# Altium schematic sheet DSO_IO.SchDoc: Schematic_Name
size A4; CompanyName: University of Melbourne; Engineer: Your Name Here; DocumentNumber: 1; Revision: 0.1; SheetNumber: 1; SheetTotal: 1; Title_Project: Project_Title; StudentNo: Student No.
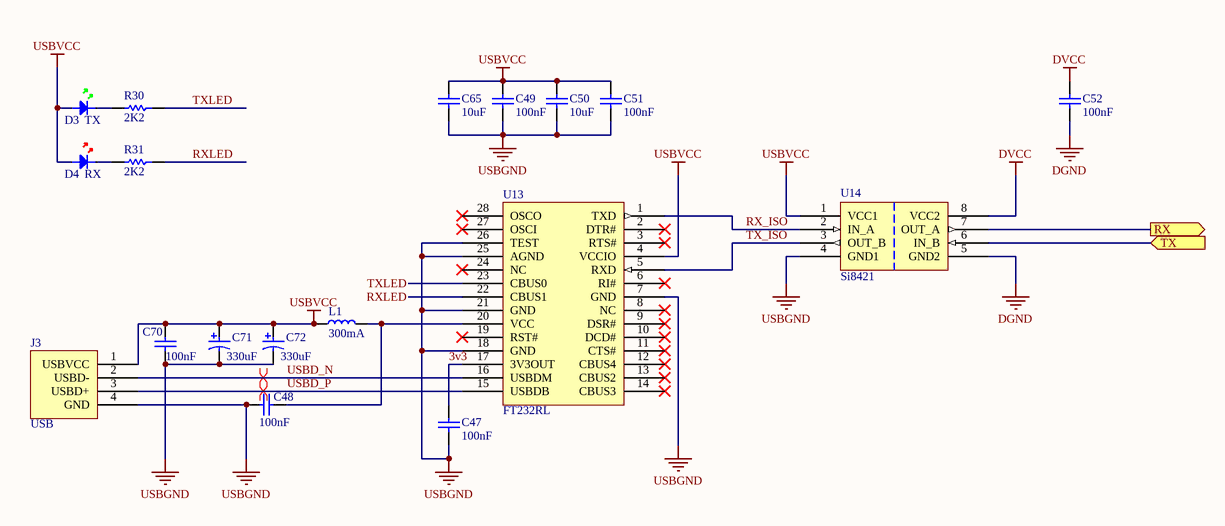
[diagram p0: DSO_IO.SchDoc]

## Parts
C47  100nF  [0805C]
C48  100nF  [0805C]
C49  100nF  [0805C]
C50  10uF  [0805C]
C51  100nF  [0805C]
C52  100nF  [0805C]
C65  10uF  [0805C]
C70  100nF  [0805C]
C71  Capacitance: 330uF  [CAPMP7344X31-T_V]  (hidden comment: TPSD337K006R0050)
C72  Capacitance: 330uF  [CAPMP7344X31-T_V]  (hidden comment: TPSD337K006R0050)
D3  TX  [0805D-GREEN]
D4  RX  [0805D-RED]
J3  USB  [USBPLUG]
L1  300mA  [0805]
R30  2K2  [0805]
R31  2K2  [0805]
U13  FT232RL  [SSOP-28]
U14  Si8421  [SOIC-8]

## Ports
RX (out), TX (in)

## Nets
DGND: C52.2 U14.5(GND2)
DVCC: C52.1 U14.8(VCC2)
USBGND: C47.2 C48.1 C49.2 C50.2 C51.2 C65.2 C70.2 C71.2 C72.2 J3.4(GND) U13.7(GND) U13.18(GND) U13.21(GND) U13.25(AGND) U13.26(TEST) U14.4(GND1)
USBVCC: C49.1 C50.1 C51.1 C65.1 C70.1 C71.1 C72.1 D3.A D4.A J3.1(USBVCC) L1.1 U13.4(VCCIO) U14.1(VCC1)
3v3: C47.1 U13.17(3V3OUT)
RX: U14.7(OUT_A) ; port RX
RX_ISO: U13.1(TXD) U14.2(IN_A)
RXLED: R31.1 U13.22(CBUS1)
TX: U14.6(IN_B) ; port TX
TX_ISO: U13.5(RXD) U14.3(OUT_B)
TXLED: R30.1 U13.23(CBUS0)
USBD_N: J3.2(USBD-) U13.16(USBDM)
USBD_P: J3.3(USBD+) U13.15(USBDB)
NetC48_2: C48.2 L1.2 U13.20(VCC)
NetD3_K: D3.K R30.2
NetD4_K: D4.K R31.2

Not connected (* = marked no-connect by the designer): U13 2(DTR#)* 3(RTS#)* 6(RI#)* 8(NC)* 9(DSR#)* 10(DCD#)* 11(CTS#)* 12(CBUS4)* 13(CBUS2)* 14(CBUS3)* 19(RST#)* 24(NC)* 27(OSCI)* 28(OSCO)*

## Layout directives
differential pair: USBD_N, USBD_P

## Library data of the parts
C47-C52 C65 C70 = C: Capacitor; Reviewed by: RM - 2018/08/05; Revision: July-2002: Re-released for DXP Platform.; Supplier 1: *; Supplier Part Number 1: *
  C47-C49 C51 C52 C70: Value: 100nF
  C50 C65: Value: 10uF
C71 C72 = CMP-2000-07305-1: Low ESR, 330 uF, 6.3 V, +/- 10%, -55 to 125 degC, 2-Pin SMD, RoHS, Tape and Reel; Manufacturer: AVX; Rad Hardened: No; DF: 8%; Product Depth (mm): 4.3mm; Wire Form: NotRequired; Lead Spacing (nom): NotRequiredmm; Case Style: Molded; Product Length (mm): 7.3mm; Voltage: 6.3VDC; DCL: 20.8uA; ESR: 0.05ohm; Product Height (mm): 2.9mm; Polarity: Polar; Datasheet URL: http://datasheets.avx.com/TPS.pdf; Mounting Style: SurfaceMount; Length W/Weld (max): NotRequiredmm; Construction: SMTChip; Package / Case: 7343-31; Product Diameter (mm): NotRequiredmm; Mounting Technology: SurfaceMount; Insulation: NotRequired; Operating Temp Range: -55Cto125C; Tolerance (+ or -): 10%; Failure Rate: NotRequired; Package URL: http://www.avx.com/download/software/literature/AVX-Footprint-Library.pdf; Packaging: TapeandReel; Case Code: D; Length W/Weld: NotRequiredmm; Manufacturer URL: http://www.avx.com/; Datasheet Version: 01/2017; Package Reference: CAPMP7344X31-T; Seated Plane Height: NotRequiredmm; Seal: NotRequired; Package Description: 2-Pin Surface Mount Device, Body 7.3 x 4.35 mm
D3 = LED GREEN: Light Emitting Diode; Reviewed by: RM - 2018/08/05; Revision: July-2002: Re-released for DXP Platform.; Supplier 1: Digi-Key; Supplier Part Number 1: 160-1423-1-ND
D4 = LED RED: Light Emitting Diode; Reviewed by: RM - 2018/08/05; Revision: July-2002: Re-released for DXP Platform.; Supplier 1: Digi-Key; Supplier Part Number 1: 475-1415-1-ND
J3 = USBPLUG: USB B Type Connector; Reviewed by: RM - 2018/08/05; Supplier 1: Digi-Key; Supplier Part Number 1: 609-1039-ND
L1 = I: Inductor; Reviewed by: RM - 2018/08/05; Value: 300mA; Supplier 1: *; Supplier Part Number 1: *
R30 R31 = R: Resistor; Reviewed by: RM - 2018/08/05; Value: 2K2; Supplier 1: *; Suppler Part Number 1: *
U13 = FT232RL: USB to Serial bridge; Reviewed by: RM - 2018/08/05; Supplier 1: Digi-Key; Supplier Part Number 1: 768-1007-1-ND
U14 = Si8421: Dual Channel Digital Isolator Both Ways; Reviewed by: RM - 2018/08/05; Supplier 1: Digi-Key; Supplier Part Number 1: 336-1755-5-ND